# Altium schematic sheet mdriver_slave.SchDoc
size A3; SheetNumber: 1; SheetTotal: 3
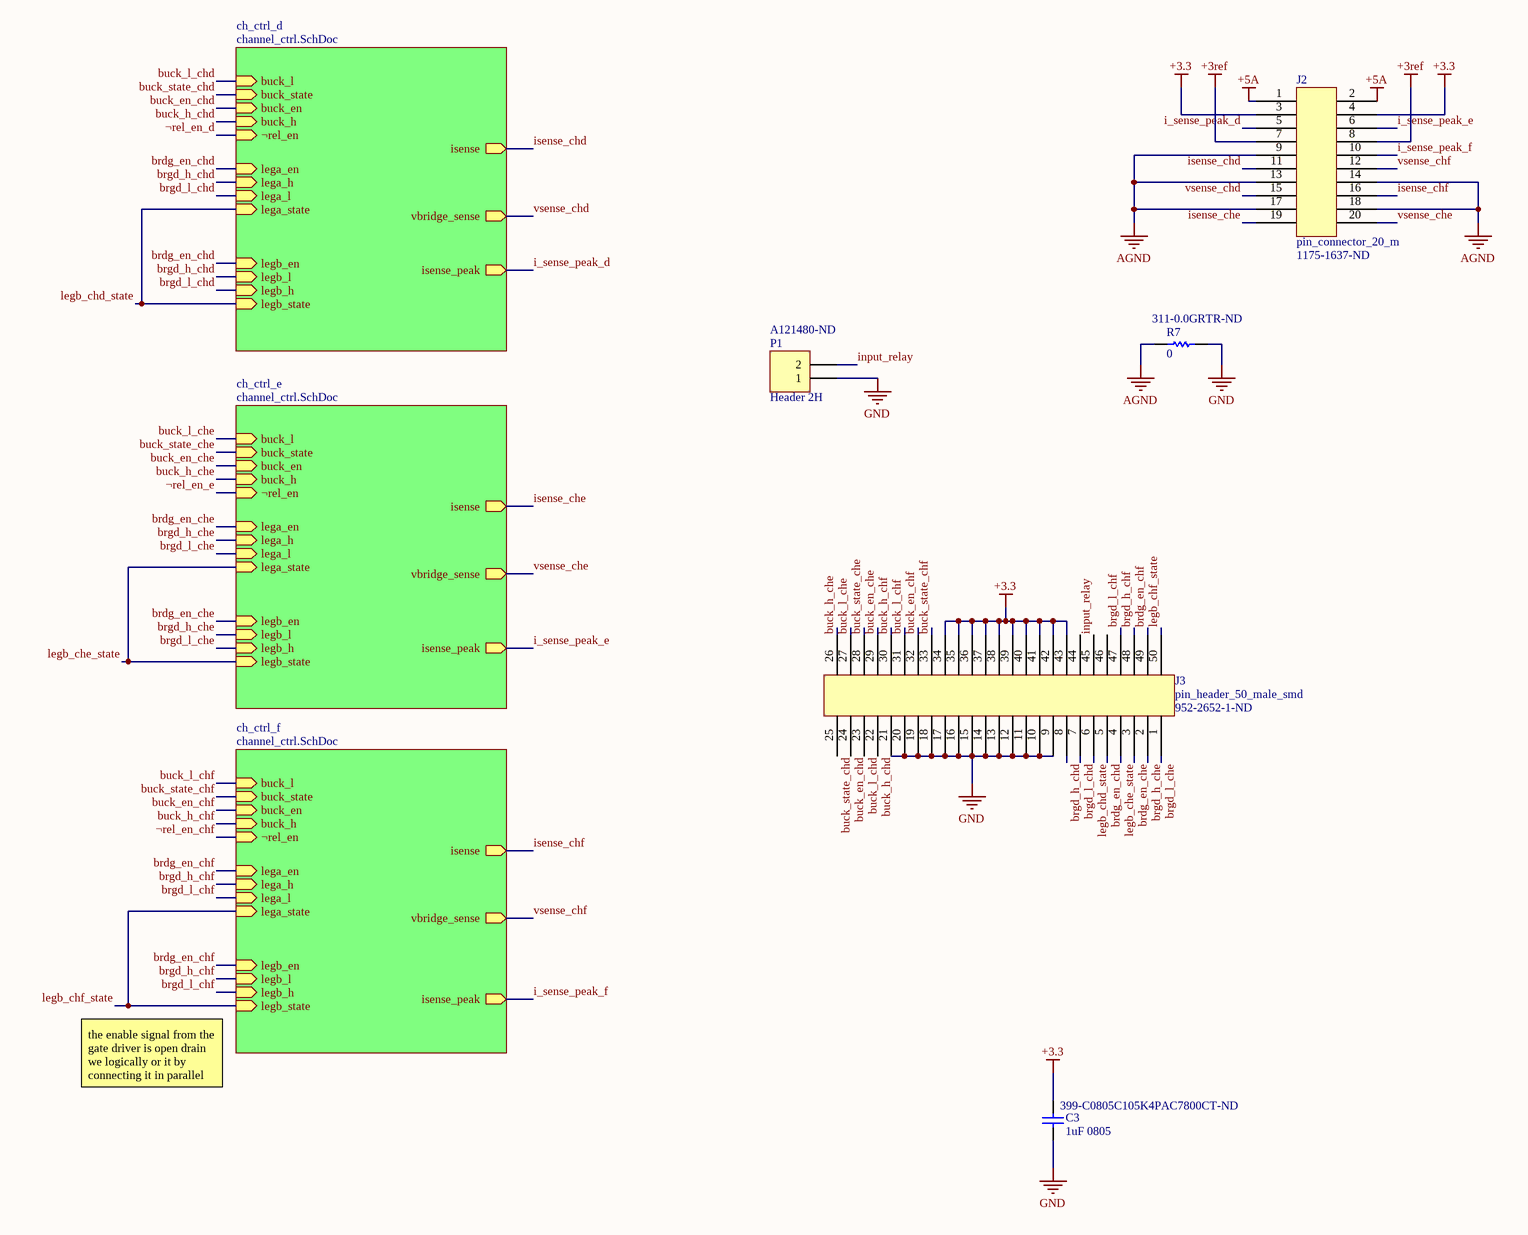
[diagram p0: mdriver_slave.SchDoc]

## Parts
C3  1uF 0805  Supplier Part Number 1: 399-C0805C105K4PAC7800CT-ND  [Model Name]
J2  pin_connector_20_m  Supplier Part Number 1: 1175-1637-ND  [PIN_20_MALE_3220-20-0300-00]
J3  pin_header_50_male_smd  Supplier Part Number 1: 952-2652-1-ND  [pin_connector_50_m_1.27_smd]
P1  Header 2H  Supplier Part Number 1: A121480-ND  [HEADER_1_2_f]
R7  0  Supplier Part Number 1: 311-0.0GRTR-ND  [RES 0603_1608]

## Sub-sheets
ch_ctrl_d = channel_ctrl.SchDoc: buck_l (in), buck_state (in), buck_en (in), buck_h (in), lega_en (in), lega_h (in), lega_l (in), lega_state (in), legb_en (in), legb_l (in), legb_h (in), legb_state (in), isense (out), vbridge_sense (out), isense_peak (out), ¬rel_en (in)
ch_ctrl_e = channel_ctrl.SchDoc: buck_l (in), buck_state (in), buck_en (in), buck_h (in), lega_en (in), lega_h (in), lega_l (in), lega_state (in), legb_en (in), legb_l (in), legb_h (in), legb_state (in), isense (out), vbridge_sense (out), ¬rel_en (in), isense_peak (out)
ch_ctrl_f = channel_ctrl.SchDoc: buck_l (in), buck_state (in), buck_en (in), buck_h (in), lega_en (in), lega_h (in), lega_l (in), lega_state (in), legb_en (in), legb_l (in), legb_h (in), legb_state (in), isense (out), vbridge_sense (out), ¬rel_en (in), isense_peak (out)

## Nets
+3.3: C3.2 J2.3 J2.4 J3.34 J3.35 J3.36 J3.37 J3.38 J3.39 J3.40 J3.41 J3.42 J3.43
+3ref: J2.7 J2.8
+5A: J2.1 J2.2
AGND: J2.9 J2.13 J2.14 J2.17 J2.18 R7.1
GND: C3.1 J3.9 J3.10 J3.11 J3.12 J3.13 J3.14 J3.15 J3.16 J3.17 J3.18 J3.19 J3.20 J3.21 P1.1 R7.2
brdg_en_chd: J3.5 ; sheet ch_ctrl_d/lega_en, sheet ch_ctrl_d/legb_en
brdg_en_che: J3.3 ; sheet ch_ctrl_e/lega_en, sheet ch_ctrl_e/legb_en
brdg_en_chf: J3.49 ; sheet ch_ctrl_f/lega_en, sheet ch_ctrl_f/legb_en
brgd_h_chd: J3.8 ; sheet ch_ctrl_d/lega_h, sheet ch_ctrl_d/legb_l
brgd_h_che: J3.2 ; sheet ch_ctrl_e/lega_h, sheet ch_ctrl_e/legb_l
brgd_h_chf: J3.48 ; sheet ch_ctrl_f/lega_h, sheet ch_ctrl_f/legb_l
brgd_l_chd: J3.7 ; sheet ch_ctrl_d/lega_l, sheet ch_ctrl_d/legb_h
brgd_l_che: J3.1 ; sheet ch_ctrl_e/lega_l, sheet ch_ctrl_e/legb_h
brgd_l_chf: J3.47 ; sheet ch_ctrl_f/lega_l, sheet ch_ctrl_f/legb_h
buck_en_chd: J3.24 ; sheet ch_ctrl_d/buck_en
buck_en_che: J3.29 ; sheet ch_ctrl_e/buck_en
buck_en_chf: J3.32 ; sheet ch_ctrl_f/buck_en
buck_h_chd: J3.22 ; sheet ch_ctrl_d/buck_h
buck_h_che: J3.26 ; sheet ch_ctrl_e/buck_h
buck_h_chf: J3.30 ; sheet ch_ctrl_f/buck_h
buck_l_chd: J3.23 ; sheet ch_ctrl_d/buck_l
buck_l_che: J3.27 ; sheet ch_ctrl_e/buck_l
buck_l_chf: J3.31 ; sheet ch_ctrl_f/buck_l
buck_state_chd: J3.25 ; sheet ch_ctrl_d/buck_state
buck_state_che: J3.28 ; sheet ch_ctrl_e/buck_state
buck_state_chf: J3.33 ; sheet ch_ctrl_f/buck_state
i_sense_peak_d: J2.5 ; sheet ch_ctrl_d/isense_peak
i_sense_peak_e: J2.6 ; sheet ch_ctrl_e/isense_peak
i_sense_peak_f: J2.10 ; sheet ch_ctrl_f/isense_peak
input_relay: J3.45 P1.2
isense_chd: J2.11 ; sheet ch_ctrl_d/isense
isense_che: J2.19 ; sheet ch_ctrl_e/isense
isense_chf: J2.16 ; sheet ch_ctrl_f/isense
legb_chd_state: J3.6 ; sheet ch_ctrl_d/lega_state, sheet ch_ctrl_d/legb_state
legb_che_state: J3.4 ; sheet ch_ctrl_e/lega_state, sheet ch_ctrl_e/legb_state
legb_chf_state: J3.50 ; sheet ch_ctrl_f/lega_state, sheet ch_ctrl_f/legb_state
vsense_chd: J2.15 ; sheet ch_ctrl_d/vbridge_sense
vsense_che: J2.20 ; sheet ch_ctrl_e/vbridge_sense
vsense_chf: J2.12 ; sheet ch_ctrl_f/vbridge_sense
¬rel_en_chf: sheet ch_ctrl_f/¬rel_en
¬rel_en_d: sheet ch_ctrl_d/¬rel_en
¬rel_en_e: sheet ch_ctrl_e/¬rel_en

Not connected (* = marked no-connect by the designer): J3 44 46

## Notes on the sheet
- the enable signal from the gate driver is open drain
  we logically or it by connecting it in parallel
- 1
- 2
- 3
- 4
- 5
- 6
- 7
- 8
- A
- B
- C
- D
- Project:
- Date:
- Drawing number:
- Rev:
- Format:
- A3
- Drawn by:
- Laboratory:
- Page
- Sheet:
- of
- File:

## Library data of the parts
C3 = Cap: Capacitor; Published: 8-Jun-2000; LatestRevisionDate: 17-Jul-2002; LatestRevisionNote: Re-released for DXP Platform.; PackageReference: RAD-0.3; Publisher: Altium Limited; PackageDescription: Radial Cap, Thru-Hole; 2 Leads; 0.3 in Pin Spacing; Value: 1uF; Supplier 1: Digi-Key
J3 = pin_header_50_male_smd: Mating Product : 952-2565-ND; Supplier 1: Digi-Key
P1 = Header 2H: Header, 2-Pin, Right Angle; LatestRevisionDate: 17-Jul-2002; LatestRevisionNote: Re-released for DXP Platform.; Publisher: Altium Limited; Supplier 1: Digi-Key
R7 = Res1: Resistor; Published: 8-Jun-2000; LatestRevisionDate: 17-Jul-2002; LatestRevisionNote: Re-released for DXP Platform.; PackageReference: AXIAL-0.3; Publisher: Altium Limited; PackageDescription: Axial Device, Thru-Hole; 2 Leads; 0.3 in Pin Spacing; Supplier 1: Digi-Key
J2 = pin_connector_20_m: Supplier 1: Digi-Key